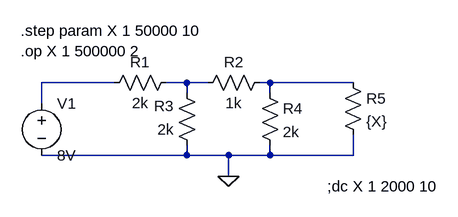
[diagram p0: schematic Clase 3. Thevenin .asc]
Clase 3. Thevenin .asc, the LTspice schematic file:
Version 4
SHEET 1 880 680
WIRE 144 80 32 80
WIRE 256 80 224 80
WIRE 288 80 256 80
WIRE 384 80 368 80
WIRE 512 80 384 80
WIRE 256 96 256 80
WIRE 384 96 384 80
WIRE 32 112 32 80
WIRE 256 192 256 176
WIRE 256 192 32 192
WIRE 320 192 256 192
WIRE 384 192 384 176
WIRE 384 192 320 192
WIRE 512 192 512 160
WIRE 512 192 384 192
WIRE 320 224 320 192
FLAG 320 224 0
SYMBOL voltage 32 96 R0
SYMATTR InstName V1
SYMATTR Value 8V
SYMBOL res 240 64 R90
WINDOW 0 0 56 VBottom 2
WINDOW 3 32 56 VTop 2
SYMATTR InstName R1
SYMATTR Value 2k
SYMBOL res 272 192 R180
WINDOW 0 36 76 Left 2
WINDOW 3 36 40 Left 2
SYMATTR InstName R3
SYMATTR Value 2k
SYMBOL res 272 96 R270
WINDOW 0 32 56 VTop 2
WINDOW 3 0 56 VBottom 2
SYMATTR InstName R2
SYMATTR Value 1k
SYMBOL res 368 80 R0
SYMATTR InstName R4
SYMATTR Value 2k
SYMBOL res 496 64 R0
SYMATTR InstName R5
SYMATTR Value {X}
TEXT 0 0 Left 2 !.step param X 1 50000 10\n.op X 1 500000 2
TEXT 472 240 Left 2 !;dc X 1 2000 10

The netlist it stands for:
* Clase 3. Thevenin .asc
V1 N001 0 8V
R1 N002 N001 2k
R3 0 N002 2k
R2 N002 N003 1k
R4 N003 0 2k
R5 N003 0 {X}
.step param X 1 50000 10
.op X 1 500000 2
;dc X 1 2000 10
.backanno
.end